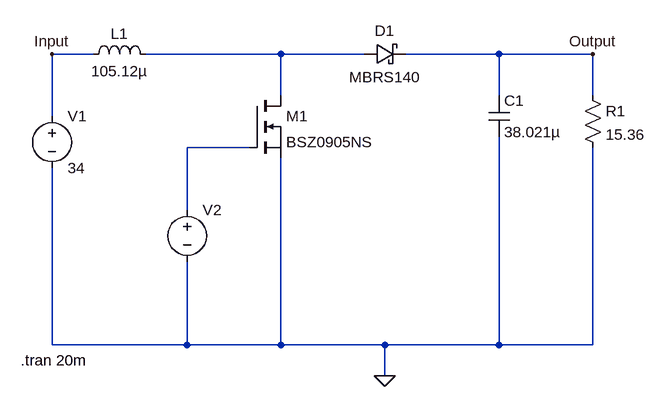
[diagram p0: schematic EC5051_Design Task_eg19.asc]
EC5051_Design Task_eg19.asc, the LTspice schematic file:
Version 4
SHEET 1 880 680
WIRE -32 48 -96 48
WIRE 256 48 48 48
WIRE 384 48 256 48
WIRE 592 48 448 48
WIRE 736 48 592 48
WIRE 256 112 256 48
WIRE 592 112 592 48
WIRE 736 112 736 48
WIRE -96 144 -96 48
WIRE 208 192 112 192
WIRE 112 288 112 192
WIRE -96 496 -96 224
WIRE 112 496 112 368
WIRE 112 496 -96 496
WIRE 256 496 256 208
WIRE 256 496 112 496
WIRE 416 496 256 496
WIRE 592 496 592 176
WIRE 592 496 416 496
WIRE 736 496 736 192
WIRE 736 496 592 496
WIRE 416 544 416 496
FLAG -96 48 Input
FLAG 736 48 Output
FLAG 416 544 0
SYMBOL voltage -96 128 R0
WINDOW 123 0 0 Left 0
WINDOW 39 0 0 Left 0
SYMATTR InstName V1
SYMATTR Value 34
SYMBOL voltage 112 272 R0
WINDOW 3 24 44 Invisible 2
WINDOW 123 0 0 Left 0
WINDOW 39 0 0 Left 0
SYMATTR Value PULSE(0 3.171 0 0 0 2.92u 10u)
SYMATTR InstName V2
SYMBOL ind -48 64 R270
WINDOW 0 32 56 VTop 2
WINDOW 3 5 56 VBottom 2
SYMATTR InstName L1
SYMATTR Value 105.12µ
SYMBOL res 720 96 R0
SYMATTR InstName R1
SYMATTR Value 15.36
SYMBOL nmos 208 112 R0
SYMATTR InstName M1
SYMATTR Value BSZ0905NS
SYMBOL cap 576 112 R0
SYMATTR InstName C1
SYMATTR Value 38.021µ
SYMBOL schottky 384 64 R270
WINDOW 0 36 32 VTop 2
WINDOW 3 -4 32 VBottom 2
SYMATTR InstName D1
SYMATTR Value MBRS140
SYMATTR Description Zener Diode
SYMATTR Type zener
TEXT -144 520 Left 2 !.tran 20m

The netlist it stands for:
* EC5051_Design Task_eg19.asc
V1 Input 0 34
V2 N002 0 PULSE(0 3.171 0 0 0 2.92u 10u)
L1 Input N001 105.12µ
R1 Output 0 15.36
M1 N001 N002 0 0 BSZ0905NS
C1 Output 0 38.021µ
D1 N001 Output MBRS140
.model D D
.lib standard.dio
.model NMOS NMOS
.model PMOS PMOS
.lib standard.mos
.tran 20m
.backanno
.end